# Altium schematic sheet PERIPHERALS.SchDoc
size A4; SheetNumber: 5; SheetTotal: 5
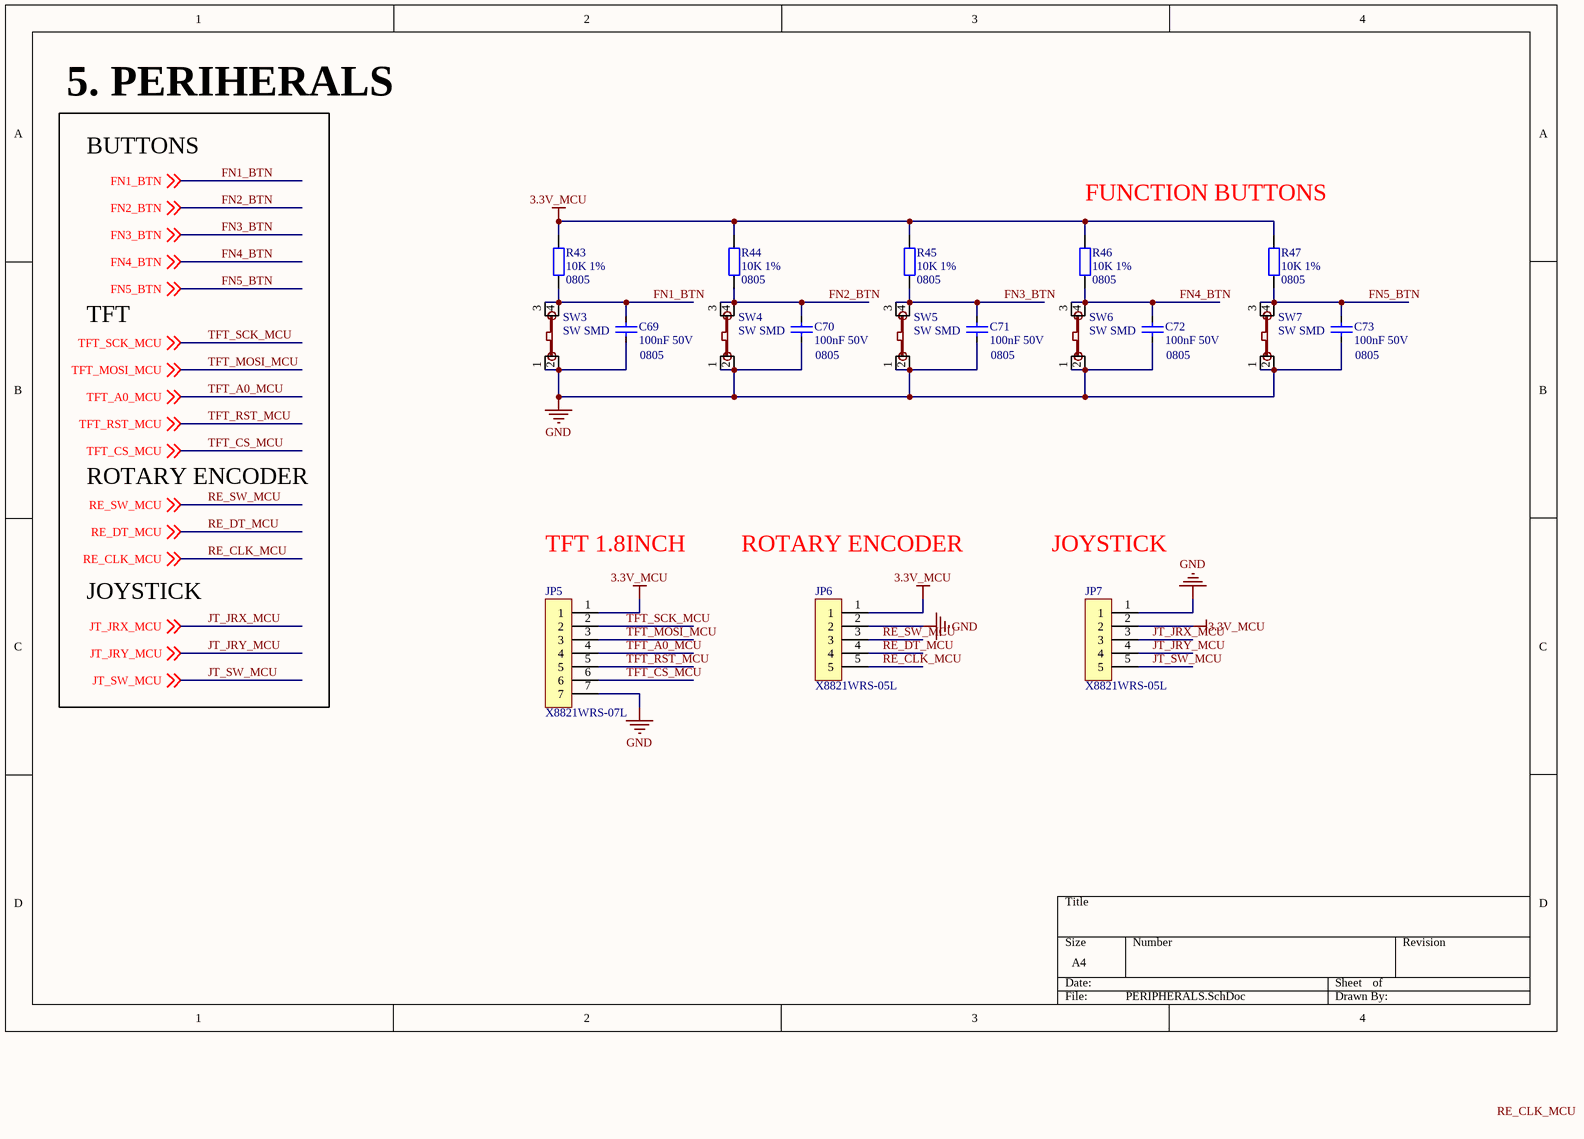
[diagram p0: PERIPHERALS.SchDoc]

## Parts
C69  100nF 50V  Size: 0805  [CAP_SMD_0805]
C70  100nF 50V  Size: 0805  [CAP_SMD_0805]
C71  100nF 50V  Size: 0805  [CAP_SMD_0805]
C72  100nF 50V  Size: 0805  [CAP_SMD_0805]
C73  100nF 50V  Size: 0805  [CAP_SMD_0805]
JP5  X8821WRS-07L  [CONN_X8821WRS-07L-LPSN]
JP6  X8821WRS-05L  [CONN_X8821WRS-05L-LPSN]
JP7  X8821WRS-05L  [CONN_X8821WRS-05L-LPSN]
R43  10K 1%  Size: 0805  [RES_SMD_0805]
R44  10K 1%  Size: 0805  [RES_SMD_0805]
R45  10K 1%  Size: 0805  [RES_SMD_0805]
R46  10K 1%  Size: 0805  [RES_SMD_0805]
R47  10K 1%  Size: 0805  [RES_SMD_0805]
SW3  SW SMD  [SMD_6X6X7]
SW4  SW SMD  [SMD_6X6X7]
SW5  SW SMD  [SMD_6X6X7]
SW6  SW SMD  [SMD_6X6X7]
SW7  SW SMD  [SMD_6X6X7]

## Nets
3.3V_MCU: JP5.1 JP6.1 JP7.2 R43.2 R44.2 R45.2 R46.2 R47.2
GND: C69.1 C70.1 C71.1 C72.1 C73.1 JP5.7 JP6.2 JP7.1 SW3.1 SW3.2 SW4.1 SW4.2 SW5.1 SW5.2 SW6.1 SW6.2 SW7.1 SW7.2
FN1_BTN: C69.2 R43.1 SW3.3 SW3.4 ; off-sheet FN1_BTN
FN2_BTN: C70.2 R44.1 SW4.3 SW4.4 ; off-sheet FN2_BTN
FN3_BTN: C71.2 R45.1 SW5.3 SW5.4 ; off-sheet FN3_BTN
FN4_BTN: C72.2 R46.1 SW6.3 SW6.4 ; off-sheet FN4_BTN
FN5_BTN: C73.2 R47.1 SW7.3 SW7.4 ; off-sheet FN5_BTN
JT_JRX_MCU: JP7.3 ; off-sheet JT_JRX_MCU
JT_JRY_MCU: JP7.4 ; off-sheet JT_JRY_MCU
JT_SW_MCU: JP7.5 ; off-sheet JT_SW_MCU
RE_CLK_MCU: JP6.5 ; off-sheet RE_CLK_MCU
RE_DT_MCU: JP6.4 ; off-sheet RE_DT_MCU
RE_SW_MCU: JP6.3 ; off-sheet RE_SW_MCU
TFT_A0_MCU: JP5.4 ; off-sheet TFT_A0_MCU
TFT_CS_MCU: JP5.6 ; off-sheet TFT_CS_MCU
TFT_MOSI_MCU: JP5.3 ; off-sheet TFT_MOSI_MCU
TFT_RST_MCU: JP5.5 ; off-sheet TFT_RST_MCU
TFT_SCK_MCU: JP5.2 ; off-sheet TFT_SCK_MCU

## Notes on the sheet
- 5. PERIHERALS
- BUTTONS
- FUNCTION BUTTONS
- TFT
- ROTARY ENCODER
- TFT 1.8INCH
- JOYSTICK
- Labels drawn without touching a wire or pin: RE_CLK_MCU

## Library data of the parts
C69-C73 = C0805_MLCC_100nF_50V: 0.1 µF ±10% 50V Ceramic Capacitor X7R 0805 (2012 Metric); Manufacturer: YAGEO; Manufacture Part Number: CC0805KRX7R9BB104; Packaging: Cut Tape (CT); Link: https://www.digikey.cn/en/products/detail/yageo/CC0805KRX7R9BB104/302874; Price: $0.10
JP5 = X8821WRS-07L: 1x7P 7P 1 Tin 2.5mm 7 Brass 3A Surface Mount，Right Angle SMD,P=2.5mm,Surface Mount，Right Angle Wire To Board Connector ROHS; Manufacturer: XKB Connection; Manufacture Part Number: X8821WRS-07-9TSN; Link: https://www.lcsc.com/product-detail/Wire-To-Board-Connector_XKB-Connection-X8821WRS-07-9TSN_C519020.html; Price: $ 0.1938
JP6 JP7 = X8821WRS-05L: 1x5P 5P XH 1 Tin 2.5mm 5 3A Brass Surface Mount，Right Angle SMD,P=2.5mm,Surface Mount，Right Angle Wire To Board Connector ROHS; Manufacturer: XKB Connection; Manufacture Part Number: X8821WRS-05-9TSN; Link: https://www.lcsc.com/product-detail/Wire-To-Board-Connector_XKB-Connection-X8821WRS-05-9TSN_C397435.html; Price: $ 0.1678
R43-R47 = R0805_10K: 10 kOhms ±1% 0.125W, 1/8W Chip Resistor 0805 (2012 Metric) Moisture Resistant Thick Film; Manufacturer: YAGEO; Manufacture Part Number: RC0805FR-0710KL; Packaging: Cut Tape (CT); Price: $0.10; Link: https://www.digikey.cn/en/products/detail/yageo/RC0805FR-0710KL/727535
SW3-SW7 = SW_SMD_6X6X7: 不带 6mm 7mm 50mA Round Button Brick nogging SPST 6mm 8万次 12V SMD Tactile Switches ROHS; Manufacturer: Shenzhen Kinghelm Elec; Manufacture Part Number: KH-6X6X7H-STM; Link: https://www.lcsc.com/product-detail/Tactile-Switches_Shenzhen-Kinghelm-Elec-KH-6X6X7H-STM_C2837533.html; Price: $ 0.0185